# Altium project Receiver.PrjPCB
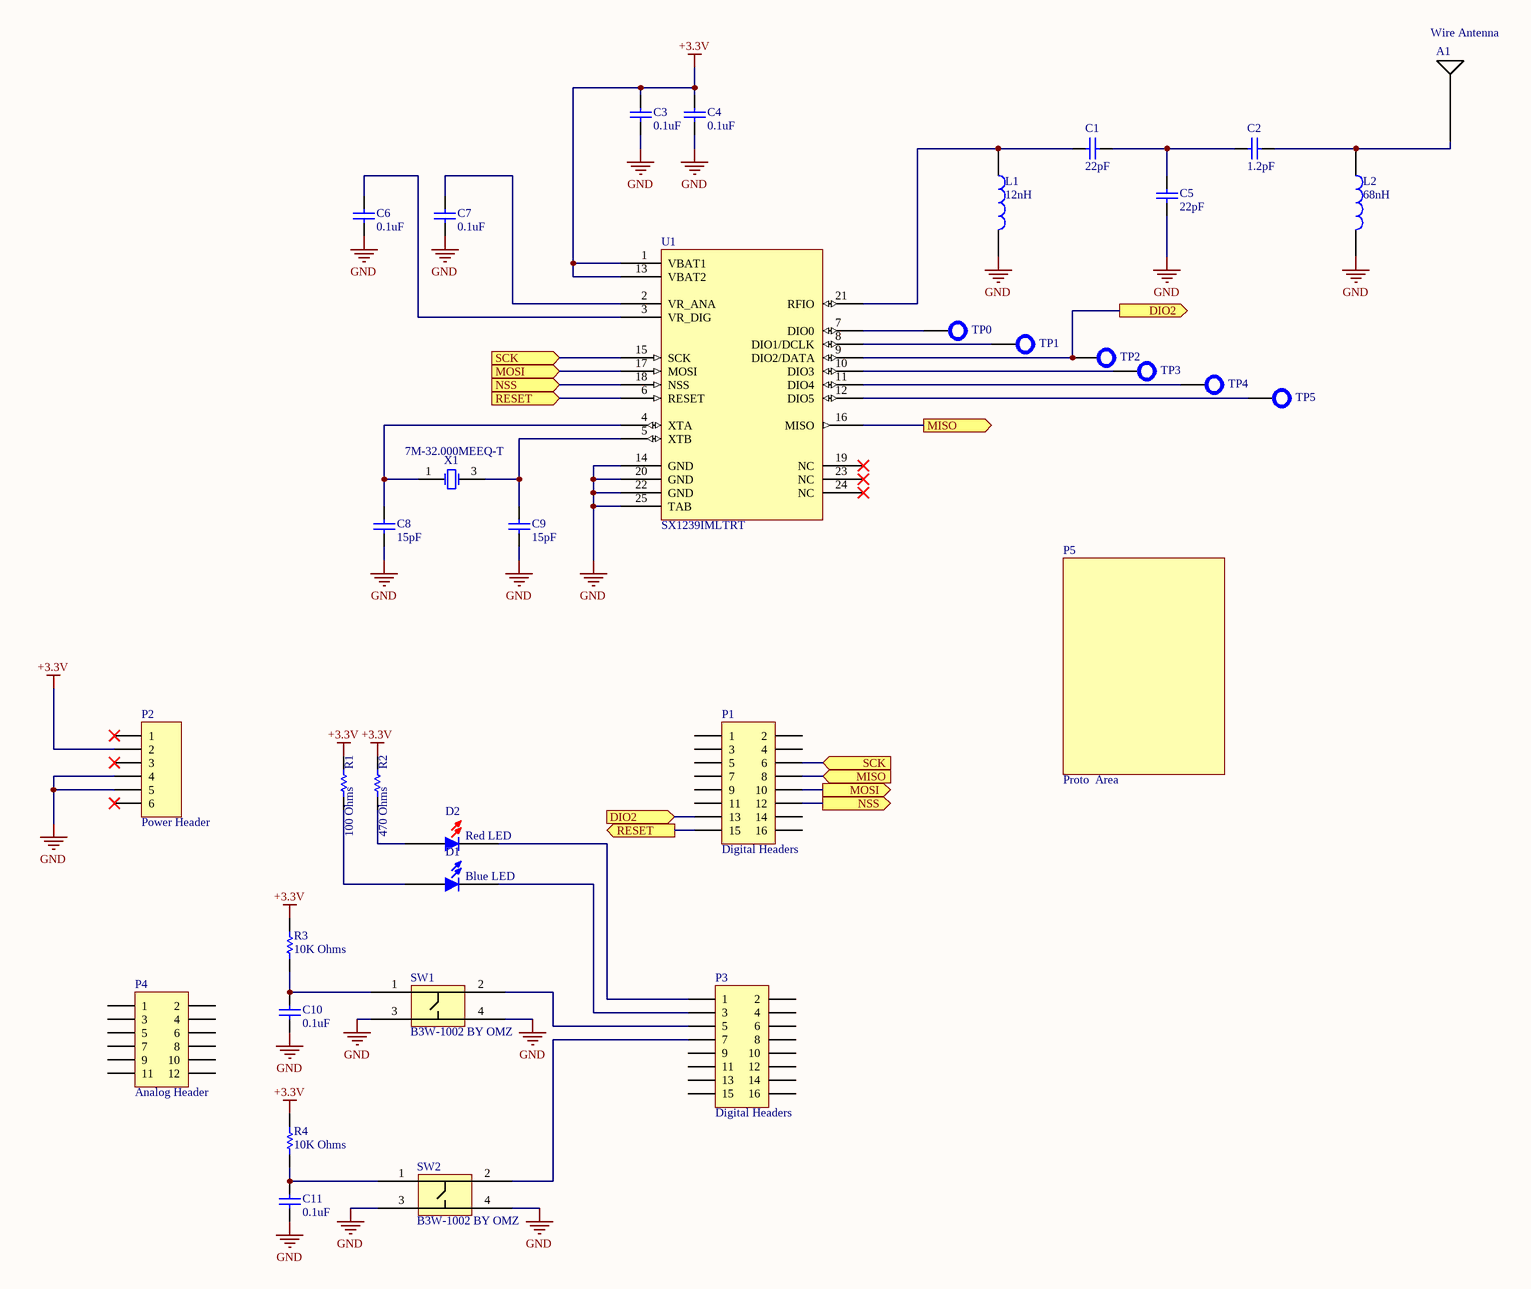
[diagram p0: receiver.SchDoc]
1 sheet, 35 parts. Net scope: flat (ports and power ports of the same name join across sheets).
Board file: receiver.PcbDoc

## Sheet receiver.SchDoc
size 431 x 279 mm

### Parts
A1  Wire Antenna  [Wire Antenna]
C1  value 22pF  [CAPC1005L]  (hidden comment: GRM1555C1H220JZ01D)
C2  value 1.2pF  [CAPC1005L]  (hidden comment: GRM1555C1H1R2CZ01D)
C3  value 0.1uF  [CAPC1005L]  (hidden comment: GRM155R71C104KA88D)
C4  value 0.1uF  [CAPC1005L]  (hidden comment: GRM155R71C104KA88D)
C5  value 22pF  [CAPC1005L]  (hidden comment: GRM1555C1H220JZ01D)
C6  value 0.1uF  [CAPC1005L]  (hidden comment: GRM155R71C104KA88D)
C7  value 0.1uF  [CAPC1005L]  (hidden comment: GRM155R71C104KA88D)
C8  value 15pF  [CAPC1005L]  (hidden comment: GRM1555C1H150JZ01D)
C9  value 15pF  [CAPC1005L]  (hidden comment: GRM1555C1H150JZ01D)
C10  value 0.1uF  [CAPC1005L]  (hidden comment: GRM155R71C104KA88D)
C11  value 0.1uF  [CAPC1005L]  (hidden comment: GRM155R71C104KA88D)
D1  Blue LED  [LEDC1608L Blue]
D2  Red LED  [LEDC1608L RED]
L1  value 12nH  [CAPC1005L]  (hidden comment: LQG15HS12NJ02D)
L2  value 68nH  [CAPC1005L]  (hidden comment: LQW15AN68NJ00D)
P1  Digital Headers  [HDR2X8]
P2  Power Header  [HDR1X6]
P3  Digital Headers  [HDR2X8]
P4  Analog Header  [HDR2X6]
P5  Proto  Area  [Proto Area]  (net tie, no BOM)
R1  value 100 Ohms  [RESC1005L]  (hidden comment: RC0402JR-07100RL)
R2  value 470 Ohms  [RESC1005L]  (hidden comment: RC0402JR-07470RL)
R3  value 10K Ohms  [RESC1005L]  (hidden comment: RC0402JR-0710KL)
R4  value 10K Ohms  [RESC1005L]  (hidden comment: RC0402JR-0710KL)
SW1  B3W-1002 BY OMZ  [B3W-1002 BY OMZ]
SW2  B3W-1002 BY OMZ  [B3W-1002 BY OMZ]
TP0  Test Point  [Test Point]  (value not drawn)  (no BOM)
TP1  Test Point  [Test Point]  (value not drawn)  (no BOM)
TP2  Test Point  [Test Point]  (value not drawn)  (no BOM)
TP3  Test Point  [Test Point]  (value not drawn)  (no BOM)
TP4  Test Point  [Test Point]  (value not drawn)  (no BOM)
TP5  Test Point  [Test Point]  (value not drawn)  (no BOM)
U1  SX1239IMLTRT  [SX1239IMLTRT]
X1  7M-32.000MEEQ-T  [ABM8G-26.000MHZ-18-D2Y-T]

### Ports
DIO2 (in), DIO2 (out), MISO (in), MISO (out), MOSI (in), MOSI (out), NSS (in), NSS (out), RESET (in), RESET (out), SCK (in)

### Nets
+3.3V: C3.2 C4.2 P2.2 R1.2 R2.2 R3.2 R4.2 U1.1(VBAT1) U1.13(VBAT2)
GND: C3.1 C4.1 C5.1 C6.1 C7.1 C8.1 C9.1 C10.1 C11.1 L1.2 L2.2 P2.4 P2.5 SW1.3 SW1.4 SW2.3 SW2.4 U1.14(GND) U1.20(GND) U1.22(GND) U1.25(TAB) X1.2 X1.4
NetA1_1: A1.1 C2.2 L2.1
NetC1_1: C1.1 L1.1 U1.21(RFIO)
NetC1_2: C1.2 C2.1 C5.2
NetC6_2: C6.2 U1.3(VR_DIG)
NetC7_2: C7.2 U1.2(VR_ANA)
NetC8_2: C8.2 U1.4(XTA) X1.1(OSC1)
NetC9_2: C9.2 U1.5(XTB) X1.3(OSC2)
NetC10_2: C10.2 R3.1 SW1.1
NetC11_2: C11.2 R4.1 SW2.1
NetD1_1: D1.1(Anode) R1.1
NetD1_2: D1.2(Cathod) P3.3
NetD2_1: D2.1(Anode) R2.1
NetD2_2: D2.2(Cathod) P3.1
NetP1_6: P1.6 U1.15(SCK) ; port SCK
NetP1_8: P1.8 U1.16(MISO) ; port MISO
NetP1_10: P1.10 U1.17(MOSI) ; port MOSI
NetP1_12: P1.12 U1.18(NSS) ; port NSS
NetP1_13: P1.13 TP2.1 U1.9(DIO2/DATA) ; port DIO2
NetP1_15: P1.15 U1.6(RESET) ; port RESET
NetP3_5: P3.5 SW1.2
NetP3_7: P3.7 SW2.2
NetTP0_1: TP0.1 U1.7(DIO0)
NetTP1_1: TP1.1 U1.8(DIO1/DCLK)
NetTP3_1: TP3.1 U1.10(DIO3)
NetTP4_1: TP4.1 U1.11(DIO4)
NetTP5_1: TP5.1 U1.12(DIO5)

Not connected (* = marked no-connect by the designer): P1 1 2 3 4 5 7 9 11 14 16; P2 1* 3* 6*; P3 2 4 6 8 9 10 11 12 13 14 15 16; P4 1 2 3 4 5 6 7 8 9 10 11 12; U1 19(NC)* 23(NC)* 24(NC)*

### Notes on the sheet
- Website: http://www.ubld.it
- Rev
- of

### Library data of the parts
C1 C5 = GRM1555C1H220JZ01D: CAP 22pF 50V CERAMIC 0402 SMD; Manufacturer: Murata; PartNumber: GRM1555C1H220JZ01D
C2 = GRM1555C1H1R2CZ01D: CAP 1.2pF 50V CERAMIC 0402 SMD; Manufacturer: Murata; PartNumber: GRM1555C1H1R2CZ01D
C3 C4 C6 C7 C10 C11 = GRM155R71C104KA88D: CAP 0.1uF 16V CERAMIC 0402 SMD; Manufacturer: Murata; PartNumber: GRM155R71C104KA88D
  C11: DNP: DNP
C8 C9 = GRM1555C1H150JZ01D: CAP 15pF 50V CERAMIC 0402 SMD; Manufacturer: Murata; PartNumber: GRM1555C1H150JZ01D
D1 = LTST-C193TBKT-5A: LED Blue 0603 SMD; Manufacturer: Lite-On Inc; PartNumber: LTST-C193TBKT-5A
D2 = LS Q976-NR-1: LED RED 0603 SMD; Manufacturer: Lite-On Inc; PartNumber: LS Q976-NR-1
L1 = LQG15HS12NJ02D: INDUCTOR 12NH 300MA 0402; Manufacturer: Murata; PartNumber: LQG15HS12NJ02D
L2 = LQW15AN68NJ00D: INDUCTOR 68NH 140MA 0402; Manufacturer: Murata; PartNumber: LQW15AN68NJ00D
P1 P3 = Digital Headers: Header, 8-Pin, Dual row; LatestRevisionDate: 17-Jul-2002; LatestRevisionNote: Re-released for DXP Platform.; Publisher: Altium Limited
P2 = Power Header: Header, 6-Pin; LatestRevisionDate: 17-Jul-2002; LatestRevisionNote: Re-released for DXP Platform.; Publisher: Altium Limited
P4 = Analog Header: Header, 6-Pin, Dual row; LatestRevisionDate: 17-Jul-2002; LatestRevisionNote: Re-released for DXP Platform.; Publisher: Altium Limited
R1 = RC0402JR-07100RL: 100 Ohms 0402; Manufacturer: Yageo; PartNumber: RC0402JR-07100RL
R2 = RC0402JR-07470RL: 470 Ohms 0402; Manufacturer: Yageo; PartNumber: RC0402JR-07470RL
R3 R4 = RC0402JR-0710KL: 10K Ohms 0402; Manufacturer: Yageo; PartNumber: RC0402JR-0710KL
  R4: DNP: DNP
SW1 SW2 = B3W-1002 BY OMZ: Manufacturer: Omron Electronics; PartNumber: B3W-1002 BY OMZ
  SW2: DNP: DNP
U1 = SX1239IMLTRT: Receiver Chip; Manufacturer: Semtech; PartNumber: SX1239IMLTRT
X1 = 7M-32.000MEEQ-T: Crystal 36.000 Mhz; Manufacturer: TXC Corporation; PartNumber: 7M-32.000MEEQ-T